# Altium schematic sheet driver.SchDoc
size A3; SheetNumber: 5; SheetTotal: 6
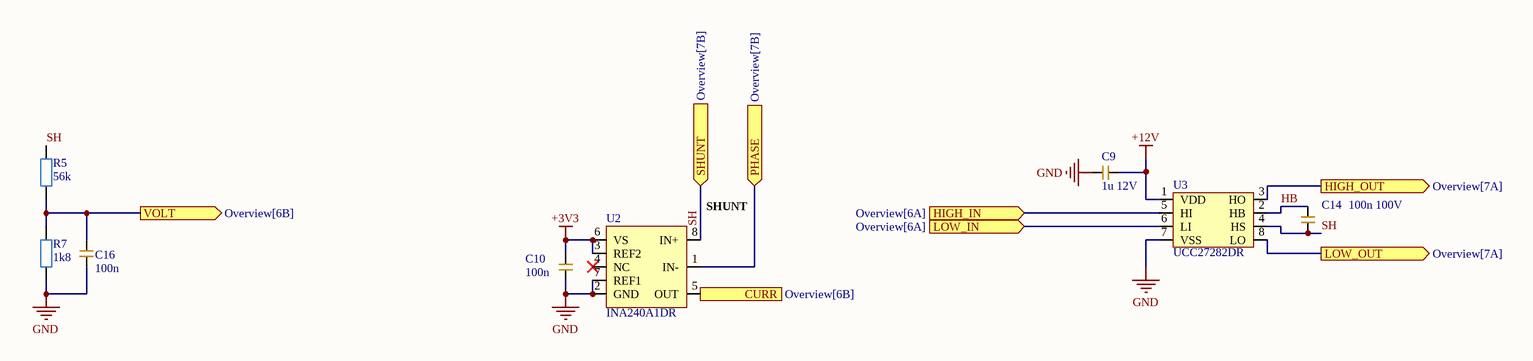
[diagram p0: driver.SchDoc]

## Parts
C9  1u 12V  [CAP_0603]
C10  100n  [CAP_0603]
C14  100n 100V  [CAP_0603]
C16  100n  [CAP_0603]
R5  56k  [RES_0603]
R7  1k8  [RES_0603]
U2  INA240A1DR  [INA240A1DR]
U3  UCC27282DR  [UCC27282DR]

## Ports
CURR (out, see Overview[6B]), HIGH_IN (in, see Overview[6A]), HIGH_OUT (out, see Overview[7A]), LOW_IN (in, see Overview[6A]), LOW_OUT (out, see Overview[7A]), PHASE (in, see Overview[7B]), SHUNT (in, see Overview[7B]), VOLT (out, see Overview[6B])

## Nets
+3V3: C10.2 U2.3(REF2) U2.6(VS)
+12V: C9.1 U3.1(VDD)
GND: C9.2 C10.1 C16.1 R7.1 U2.2(GND) U2.7(REF1) U3.7(VSS)
CURR: U2.5(OUT) ; port CURR
HB: C14.2 U3.2(HB)
HIGH_IN: U3.5(HI) ; port HIGH_IN
HIGH_OUT: U3.3(HO) ; port HIGH_OUT
LOW_IN: U3.6(LI) ; port LOW_IN
LOW_OUT: U3.8(LO) ; port LOW_OUT
PHASE: U2.1(IN-) ; port PHASE
SH: C14.1 R5.2 U2.8(IN+) U3.4(HS) ; port SHUNT
VOLT: C16.2 R5.1 R7.2 ; port VOLT

Not connected (* = marked no-connect by the designer): U2 4(NC)*

## Notes on the sheet
- (near U2) SHUNT

## Library data of the parts
C9 C10 C14 C16 = CAP_0603: Multilayer Ceramic Capacitors MLCC - SMD/SMT ROHS; Mfr.: *; Voltage Rating: *; Package: 0603; LCSC: *; Mfr. Part: *
R5 R7 = RES_0603: 100mW Thick Film Resistors; Voltage Rating: *; Mfr. Part: *; Package: 0603; LCSC: *; Mfr.: *
U2 = INA240A1DR: -4V~80V Single channel SOIC-8 Current Sense Amplifiers ROHS; Mfr.: Texas Instruments; Mfr. Part: INA240A1DR; LCSC: C2060769
U3 = UCC27282DR: Half Bridge 2 MOSFET 2.5A 12ns 10ns 5.5V~16V 3.5A SOIC-8 Gate Drivers ROHS; Mfr.: Texas Instruments; Mfr. Part: UCC27282DR; LCSC: C2867844